# EAGLE design CC3200_Breakout (EAGLE 7.1.0)
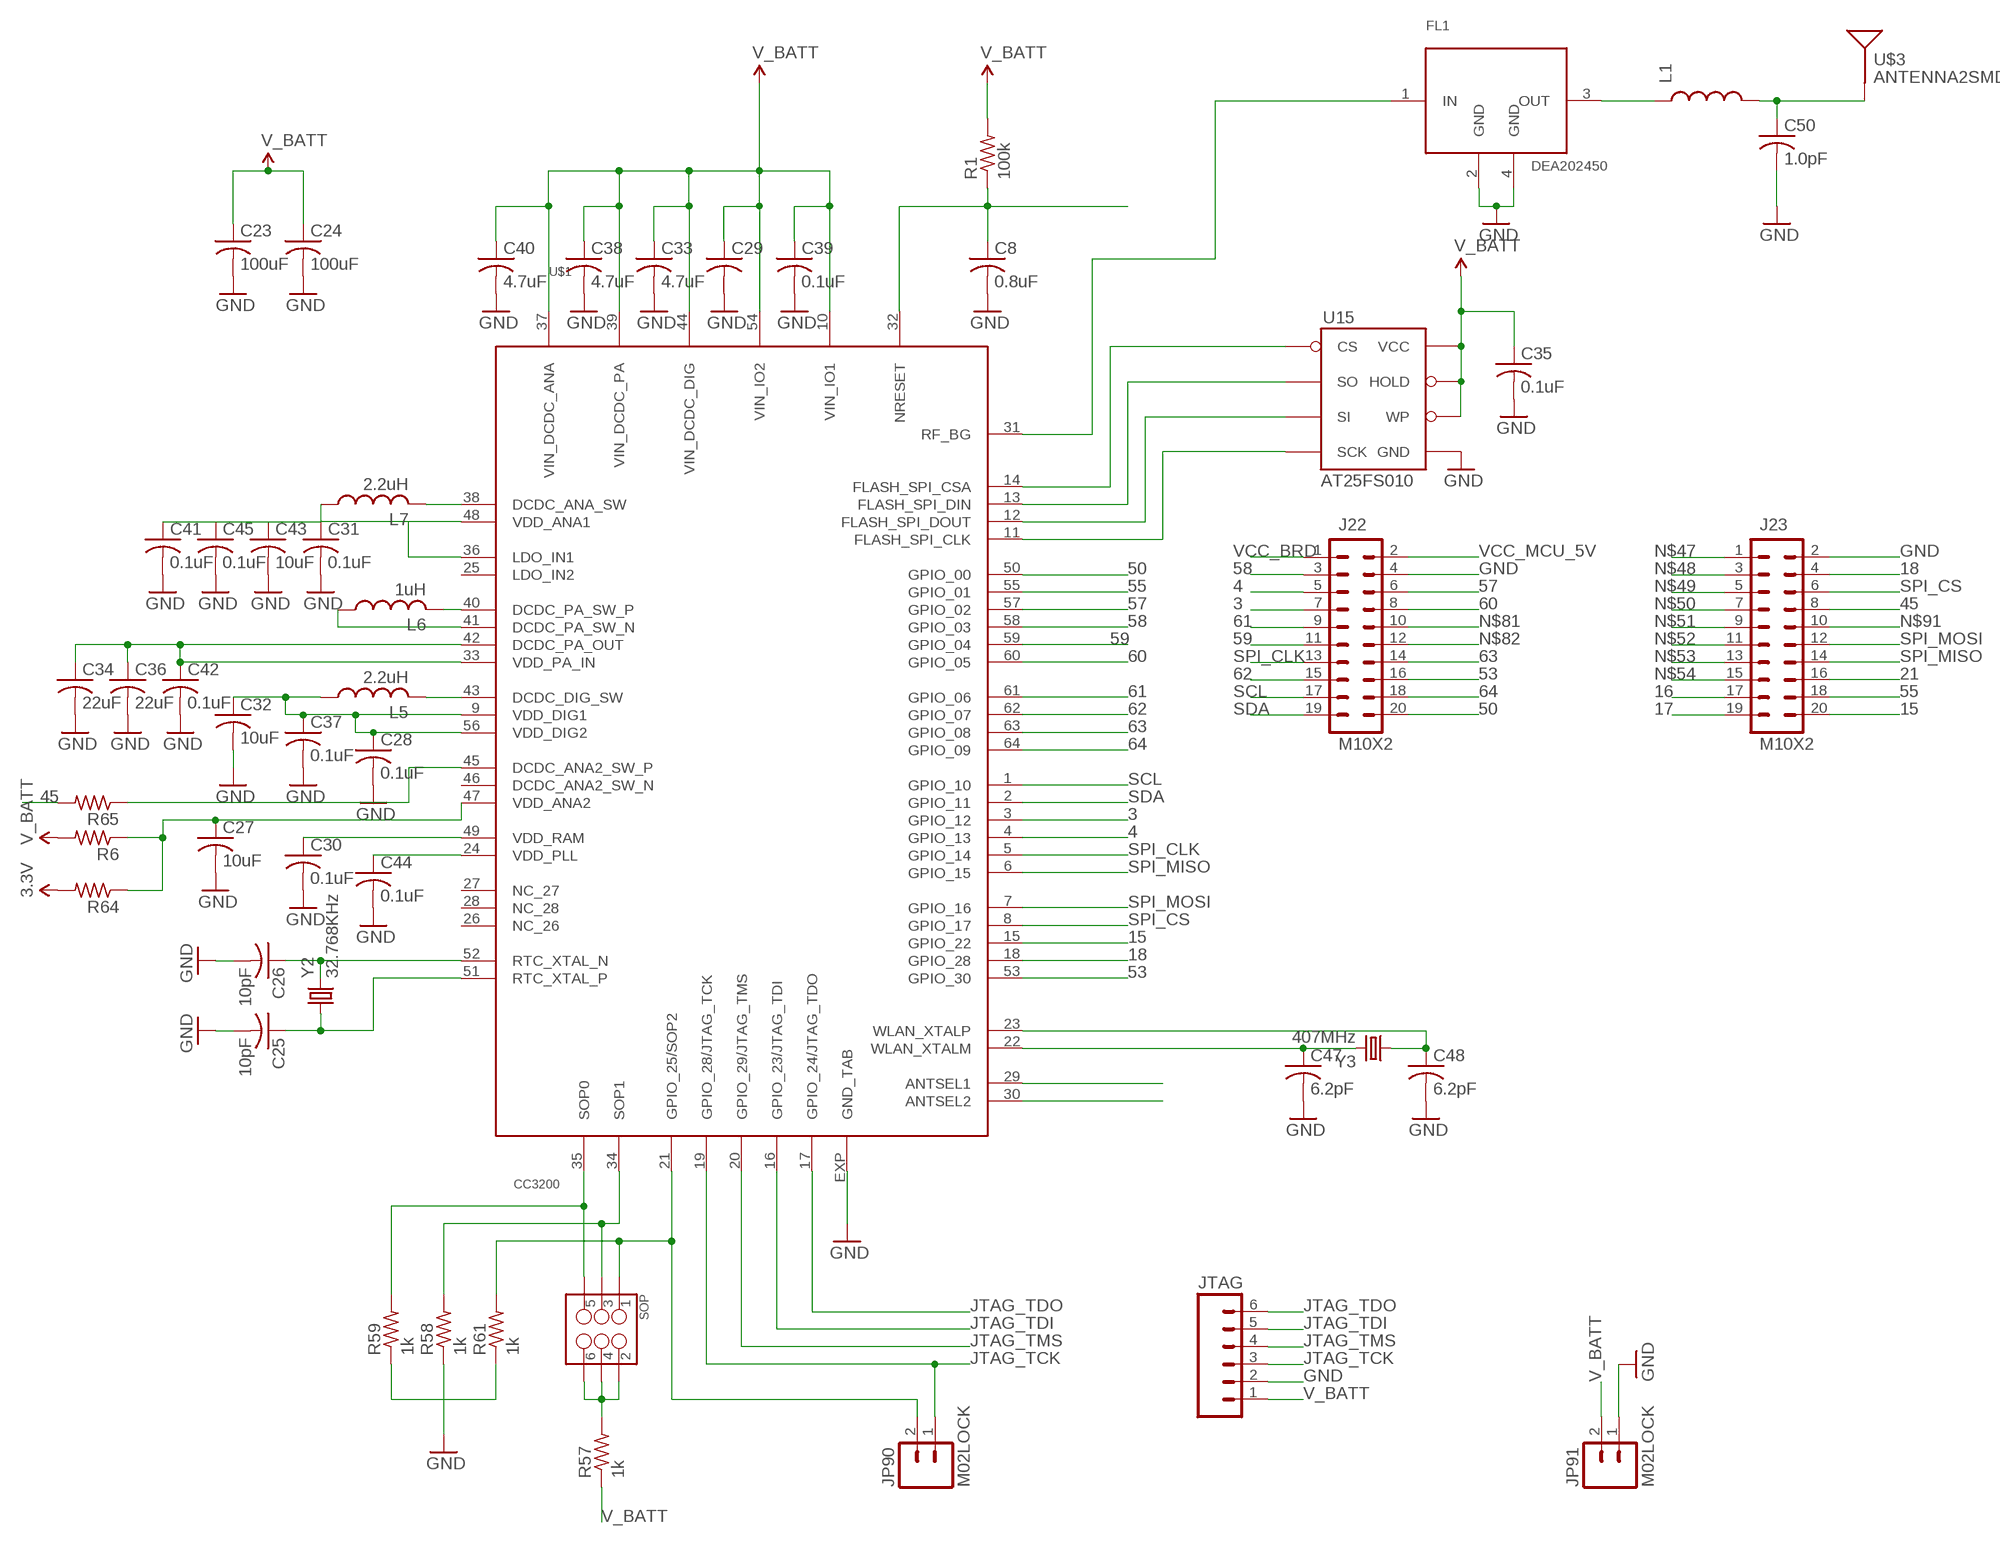
[diagram p0: schematic, sheet 1]

## Parts
C8  0.8uF  C-USC0402K  [C0402K]
C23  100uF  C-USC0402K  [C0402K]
C24  100uF  C-USC0402K  [C0402K]
C25  10pF  C-USC0402K  [C0402K]
C26  10pF  C-USC0402K  [C0402K]
C27  10uF  C-USC0402K  [C0402K]
C28  0.1uF  C-USC0402K  [C0402K]
C29  C-USC0402K  [C0402K]
C30  0.1uF  C-USC0402K  [C0402K]
C31  0.1uF  C-USC0402K  [C0402K]
C32  10uF  C-USC0402K  [C0402K]
C33  4.7uF  C-USC0402K  [C0402K]
C34  22uF  C-USC0402K  [C0402K]
C35  0.1uF  C-USC0402K  [C0402K]
C36  22uF  C-USC0402K  [C0402K]
C37  0.1uF  C-USC0402K  [C0402K]
C38  4.7uF  C-USC0402K  [C0402K]
C39  0.1uF  C-USC0402K  [C0402K]
C40  4.7uF  C-USC0402K  [C0402K]
C41  0.1uF  C-USC0402K  [C0402K]
C42  0.1uF  C-USC0402K  [C0402K]
C43  10uF  C-USC0402K  [C0402K]
C44  0.1uF  C-USC0402K  [C0402K]
C45  0.1uF  C-USC0402K  [C0402K]
C47  6.2pF  C-USC0402K  [C0402K]
C48  6.2pF  C-USC0402K  [C0402K]
C50  1.0pF  C-USC0402K  [C0402K]
FL1  DEA202450  [DEA202450]
J22  M10X2  [2X10]
J23  M10X2  [2X10]
JP90  M02LOCK  [1X02_LOCK]
JP91  M02LOCK  [1X02_LOCK]
JTAG  M06SILK_FEMALE_PTH  [1X06]
L1  INDUCTOR-SPARKFUN0402  [C0402]
L5  2.2uH  L-USL2012C  [L2012C]
L6  1uH  L-USL2012C  [L2012C]
L7  2.2uH  L-USL2012C  [L2012C]
R1  100k  R-US_R0402  [R0402]
R6  R-US_R0402  [R0402]
R57  1k  R-US_R0402  [R0402]
R58  1k  R-US_R0402  [R0402]
R59  1k  R-US_R0402  [R0402]
R61  1k  R-US_R0402  [R0402]
R64  R-US_R0402  [R0402]
R65  R-US_R0402  [R0402]
SOP  M03X22X3_SILK_MALE_PTH  [2X3]
U15  AT25FS010  [SO08WIDE]
U$1  CC3200  [PVQFN-N64]
U$3  ANTENNA2SMD  [ANTENNA-CHIP2]
Y2  32.768KHz  CRYSTAL5X3  [CRYSTAL-SMD-5X3]
Y3  407MHz  CRYSTAL5X3  [CRYSTAL-SMD-5X3]

## Nets
3: J22.7 U$1.3(GPIO_12)
3.3V: R64.2
4: J22.5 U$1.4(GPIO_13)
15: J23.20 U$1.15(GPIO_22)
16: J23.17
17: J23.19
18: J23.4 U$1.18(GPIO_28)
21: J23.16
45: J23.8 R65.2
50: J22.20 U$1.50(GPIO_00)
53: J22.16 U$1.53(GPIO_30)
55: J23.18 U$1.55(GPIO_01)
57: J22.6 U$1.57(GPIO_02)
58: J22.3 U$1.58(GPIO_03)
59: J22.11 U$1.59(GPIO_04)
60: J22.8 U$1.60(GPIO_05)
61: J22.9 U$1.61(GPIO_06)
62: J22.15 U$1.62(GPIO_07)
63: J22.14 U$1.63(GPIO_08)
64: J22.18 U$1.64(GPIO_09)
GND: C8.2 C23.2 C24.2 C25.2 C26.2 C27.2 C28.2 C29.2 C30.2 C31.2 C32.2 C33.2 C34.2 C35.2 C36.2 C37.2 C38.2 C39.2 C40.2 C41.2 C42.2 C43.2 C44.2 C45.2 C47.2 C48.2 C50.1 C50.2 FL1.2(GND) FL1.4(GND) J22.4 J23.2 JP91.1 JTAG.2 L1.2 R58.1 R59.1 R61.1 U15.4(GND) U$1.EXP(GND_TAB) U$3.FEED(SIGNAL)
JTAG_TCK: JP90.1 JTAG.3 U$1.19(GPIO_28/JTAG_TCK)
JTAG_TDI: JTAG.5 U$1.16(GPIO_23/JTAG_TDI)
JTAG_TDO: JTAG.6 U$1.17(GPIO_24/JTAG_TDO)
JTAG_TMS: JTAG.4 U$1.20(GPIO_29/JTAG_TMS)
N$1: C26.1 U$1.52(RTC_XTAL_N) Y2.3
N$2: C25.1 U$1.51(RTC_XTAL_P) Y2.1
N$3: C31.1 C41.1 C43.1 C45.1 L7.1 U$1.36(LDO_IN1) U$1.48(VDD_ANA1)
N$4: L7.2 U$1.38(DCDC_ANA_SW)
N$5: U$1.29(ANTSEL1)
N$6: R57.2 SOP.2 SOP.4 SOP.6
N$7: L6.2 U$1.40(DCDC_PA_SW_P)
N$8: L6.1 U$1.41(DCDC_PA_SW_N)
N$9: FL1.1(IN) U$1.31(RF_BG)
N$10: C34.1 C36.1 C42.1 U$1.33(VDD_PA_IN) U$1.42(DCDC_PA_OUT)
N$11: L5.2 U$1.43(DCDC_DIG_SW)
N$12: R65.1 U$1.45(DCDC_ANA2_SW_P)
N$13: R59.2 SOP.5 U$1.35(SOP0)
N$14: C8.1 R1.1 U$1.32(NRESET)
N$17: C28.1 C32.1 C37.1 L5.1 U$1.9(VDD_DIG1) U$1.56(VDD_DIG2)
N$18: C30.1 U$1.49(VDD_RAM)
N$19: C44.1 U$1.24(VDD_PLL)
N$20: C27.1 R6.1 R64.1 U$1.47(VDD_ANA2)
N$21: R58.2 SOP.3 U$1.34(SOP1)
N$22: JP90.2 R61.2 SOP.1 U$1.21(GPIO_25/SOP2)
N$27: U$1.30(ANTSEL2)
N$28: C47.1 U$1.22(WLAN_XTALM) Y3.3
N$29: C48.1 U$1.23(WLAN_XTALP) Y3.1
N$30: U15.1(CS) U$1.14(FLASH_SPI_CSA)
N$31: U15.2(SO) U$1.13(FLASH_SPI_DIN)
N$32: U15.5(SI) U$1.12(FLASH_SPI_DOUT)
N$33: U15.6(SCK) U$1.11(FLASH_SPI_CLK)
N$36: FL1.3(OUT) L1.1
N$47: J23.1
N$48: J23.3
N$49: J23.5
N$50: J23.7
N$51: J23.9
N$52: J23.11
N$53: J23.13
N$54: J23.15
N$81: J22.10
N$82: J22.12
N$91: J23.10
SCL: J22.17 U$1.1(GPIO_10)
SDA: J22.19 U$1.2(GPIO_11)
SPI_CLK: J22.13 U$1.5(GPIO_14)
SPI_CS: J23.6 U$1.8(GPIO_17)
SPI_MISO: J23.14 U$1.6(GPIO_15)
SPI_MOSI: J23.12 U$1.7(GPIO_16)
V_BATT: C23.1 C24.1 C29.1 C33.1 C35.1 C38.1 C39.1 C40.1 JP91.2 JTAG.1 R1.2 R6.2 R57.1 U15.3(WP) U15.7(HOLD) U15.8(VCC) U$1.10(VIN_IO1) U$1.37(VIN_DCDC_ANA) U$1.39(VIN_DCDC_PA) U$1.44(VIN_DCDC_DIG) U$1.54(VIN_IO2)
VCC_BRD: J22.1
VCC_MCU_5V: J22.2
Unconnected: U$1.25(LDO_IN2) U$1.26(NC_26) U$1.27(NC_27) U$1.28(NC_28) U$1.46(DCDC_ANA2_SW_N)

## Library data of the parts
C8 C23-C45 C47 C48 C50 = resistor:C-US: CAPACITOR, American symbol
FL1 = DEA202450:DEA202450
J22 J23 = SparkFun-Connectors:M10X2: This was SPECIALLY designed to be used with our Graphic LCD Backpack. Be sure you want to use this! It is not only staggered on each line of header holes, but IT IS ALSO offset of the center point of the top and bottom lines by 5 mil. This causes the headers to lock into place on the "standard" footprint on the LCD screen. The extra squares on the tdocu layer are there simply to reference other pins (if you were to actually populate a longer header than ten long - this is what we do with the backpacks).
JP90 JP91 = SparkFun-Connectors:M02: Standard 2-pin 0.1" header. Use with - straight break away headers ( PRT-00116) - right angle break away headers (PRT-00553) - swiss pins (PRT-00743) - machine pins (PRT-00117) - female headers (PRT-00115) Molex polarized connector foot print use with: PRT-08233 with associated crimp pins and housings. 2.54_SCREWTERM for use with PRT-10571. 3.5mm Screw Terminal footprints for PRT-08084 5mm Screw Terminal footprints for use with PRT-08432
JTAG = SparkFun-Connectors:M06: Header 6 Standard 6-pin 0.1" header. Use with straight break away headers (SKU : PRT-00116), right angle break away headers (PRT-00553), swiss pins (PRT-00743), machine pins (PRT-00117), and female headers (PRT-00115). Molex polarized connector foot print use with SKU : PRT-08094 with associated crimp pins and housings. NOTES ON THE VARIANTS LOCK and LOCK_LONGPADS... This footprint was designed to help hold the alignment of a through-hole component (i.e. 6-pin header) while soldering it into place. You may notice that each hole has been shifted either up or down by 0.005 of an inch from it's more standard position (which is a perfectly straight line). This slight alteration caused the pins (the squares in the middle) to touch the edges of the holes. Because they are alternating, it causes a "brace" to hold the component in place. 0.005 has proven to be the perfect amount of "off-center" position when using our standard breakaway headers. Although looks a little odd when you look at the bare footprint, once you have a header in there, the alteration is very hard to notice. Also,if you push a header all the way into place, it is covered up entirely on the bottom side. This idea of altering the position of holes to aid alignment will be further integrated into the Sparkfun Library for other footprints. It can help hold any component with 3 or more connection pins.; PROD_ID: CONN-08437
L1 = Spark:INDUCTOR-SPARKFUN: Inductors Basic Inductor/Choke - 0603 and 1206. Footprints are not proven and vary greatly between part numbers. SRN6045- 33uH, 20% 1.4A
L5-L7 = resistor:L-US: INDUCTOR, American symbol
R1 R6 R57-R59 R61 R64 R65 = resistor:R-US_: RESISTOR, American symbol
SOP = SparkFun-Connectors:M03X2: 2x3 .1" header. Shrouded, with keying- CONN-10681 SMT- CONN-11415 Pogo pins- HW-11044; PROD_ID: CONN-09701
U15 = SparkFun-DigitalIC:AT25FS010: 1-Mbit SPI flash memory
U$1 = cc3200:CC3200
U$3 = SparkFun-RF:ANTENNA2: Chip antenna Single endded antenna. Common with smaller chip antennas. CHIP4 package is the GPS Chip Antenna SKU: GPS-08418. CHIP5 package is 2.4GHz chip antenna SKU: WRL-00144.
Y2 Y3 = SparkFun-FreqCtrl:CRYSTAL: Various standard crystals. Proven footprints. Spark Fun Electronics SKU : COM-00534

## Board
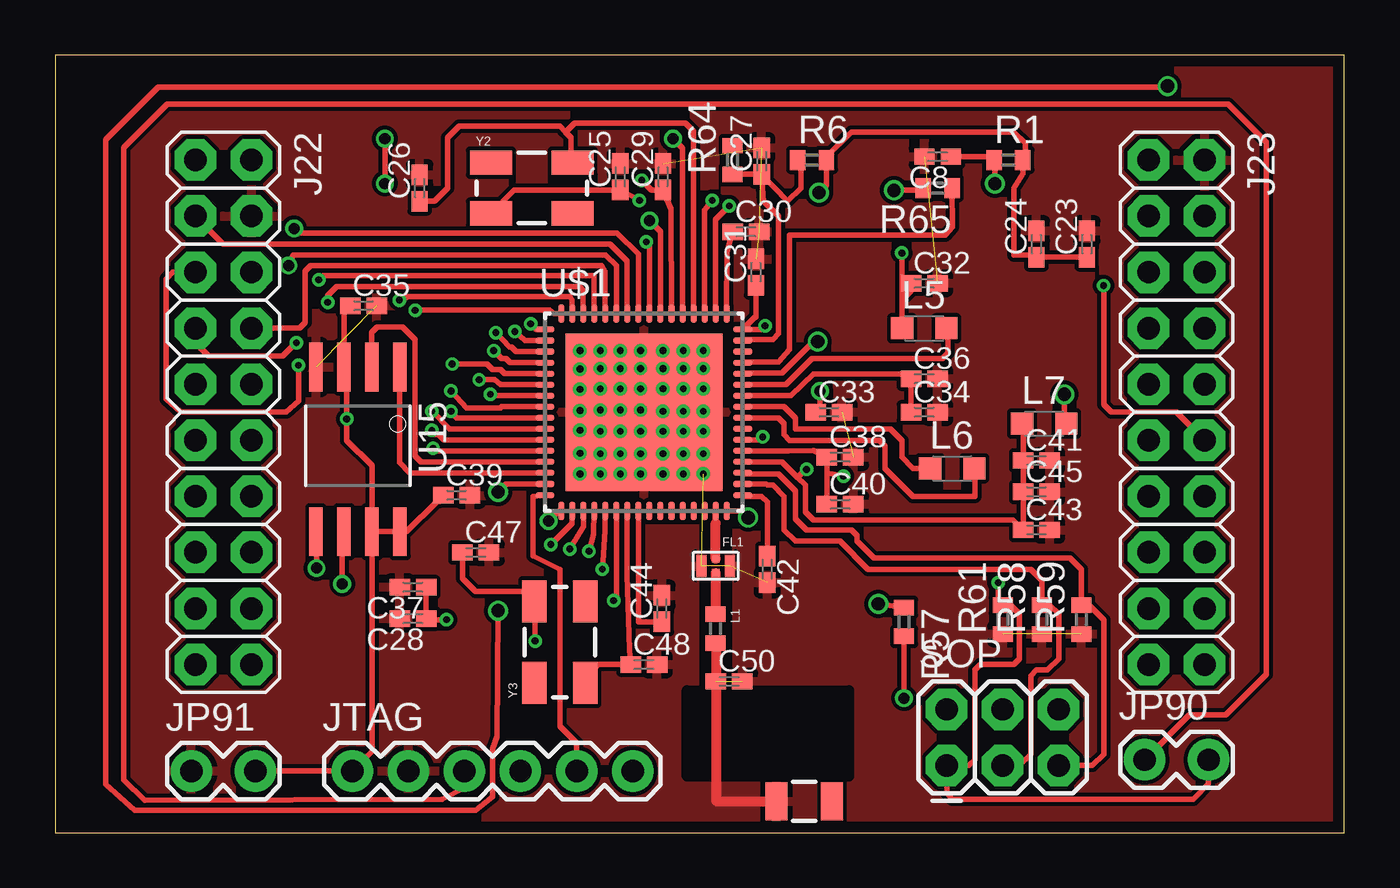
[diagram p1: board, top side]
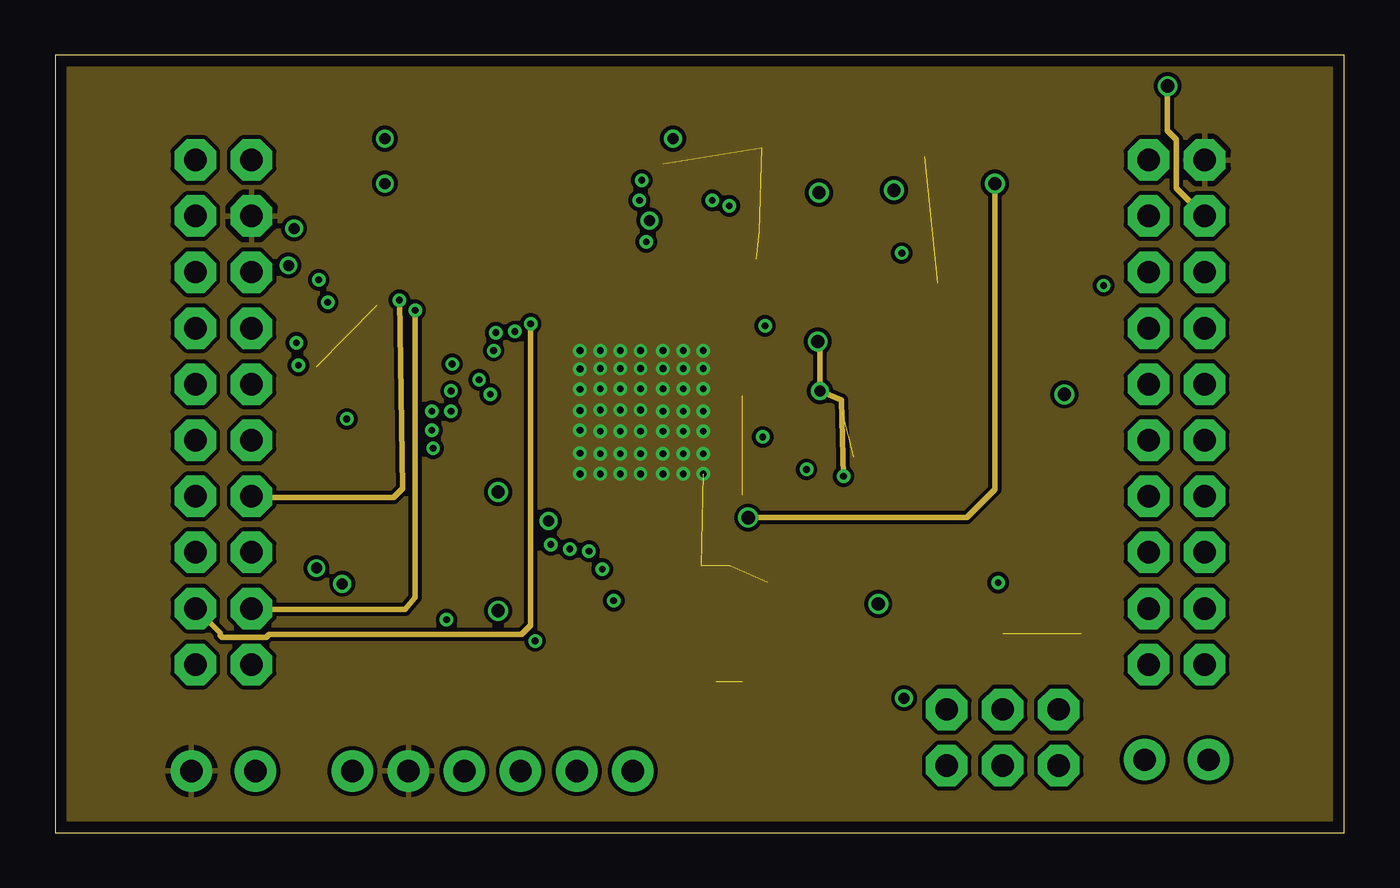
[diagram p2: board, inner layer $GND]
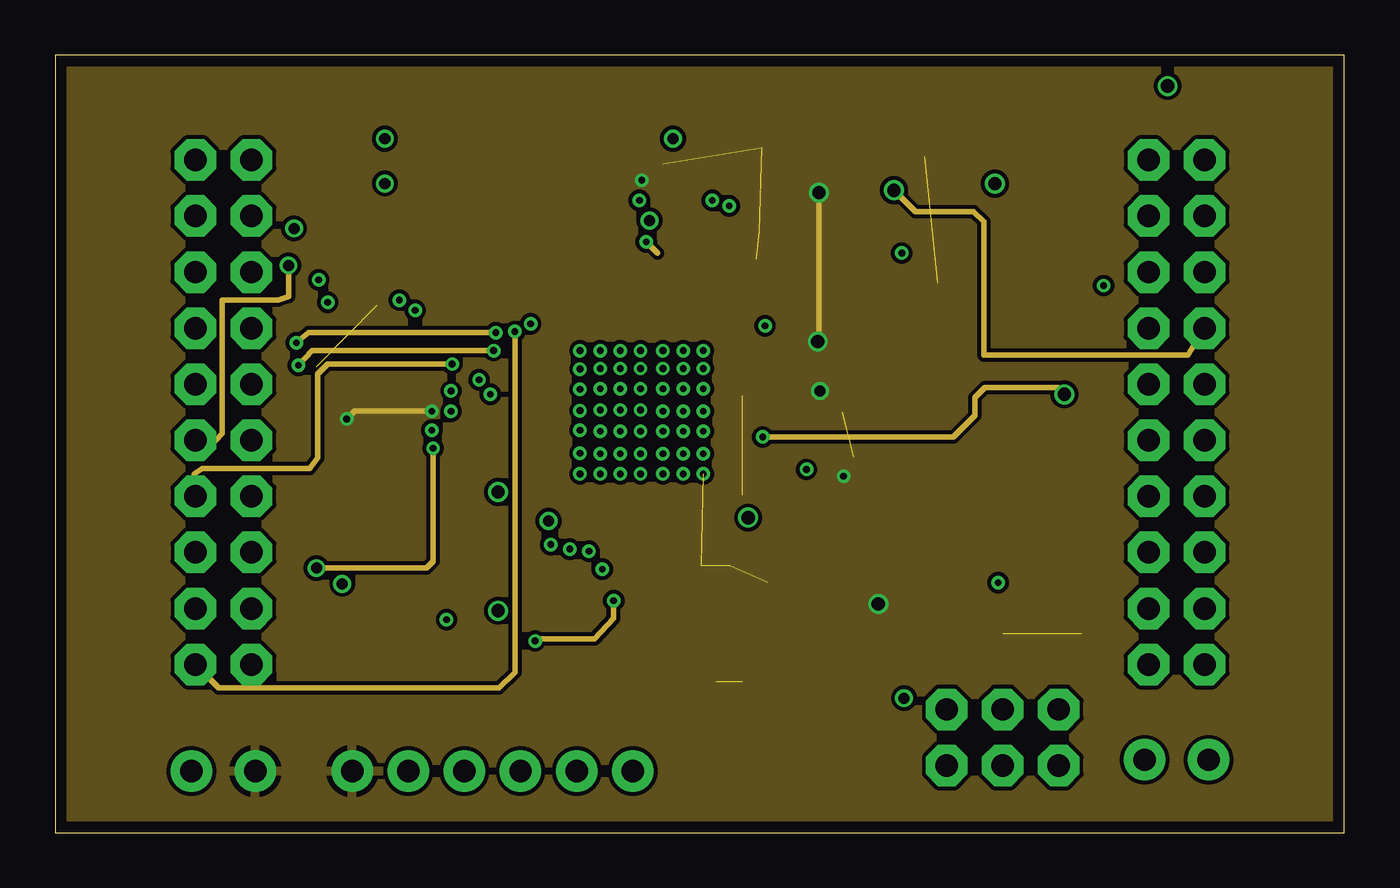
[diagram p3: board, inner layer $V_BATT]
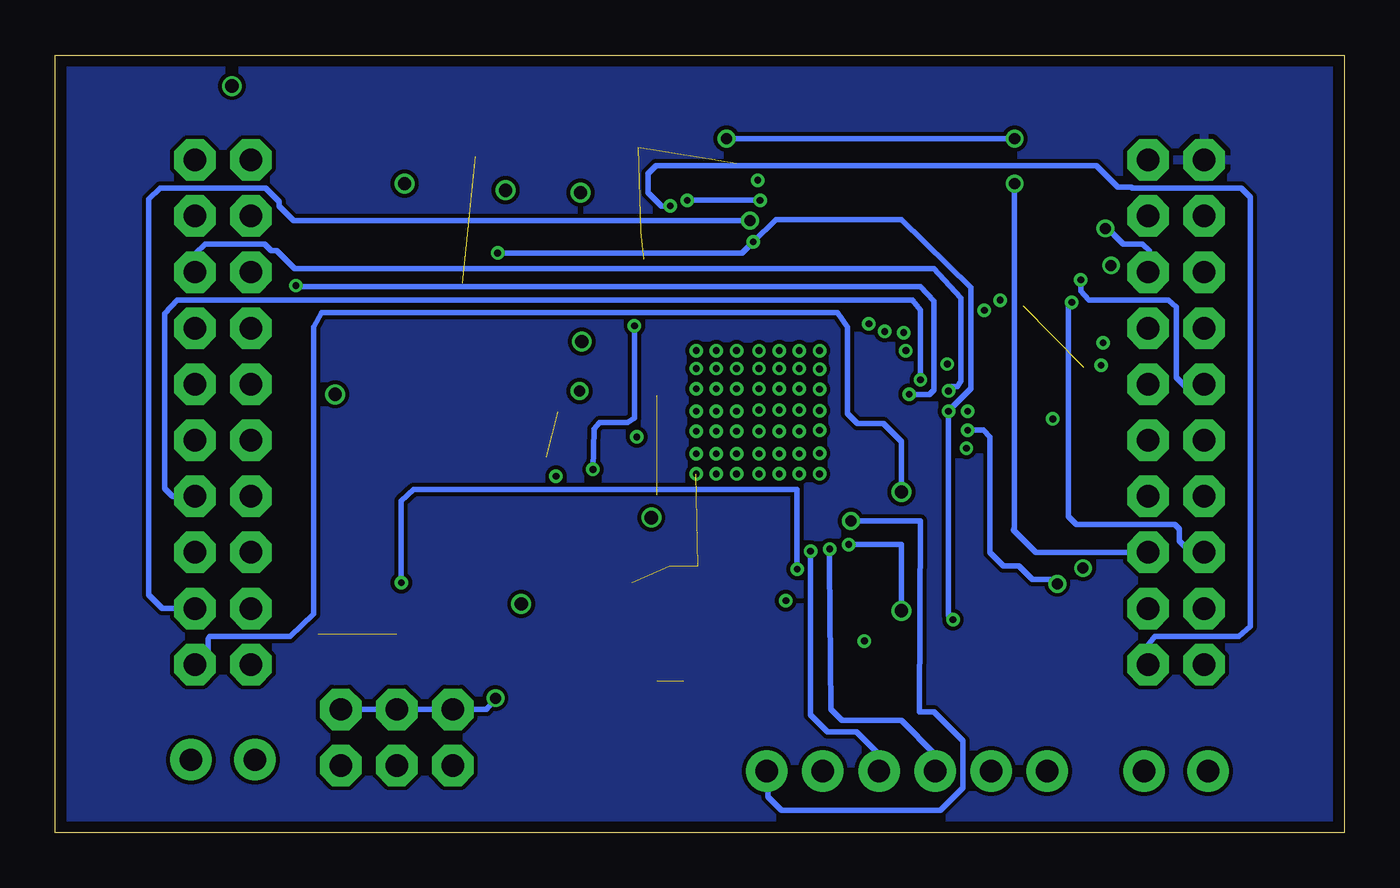
[diagram p4: board, bottom side, seen from below]

Size 58.4 x 35.23 mm. Coordinates in mm from the lower left corner, seen from the top.
Outline: 0,0 58.4,0 58.4,35.23 0,35.23 0,0
Copper layers (1*2*15*16): Top 0.035mm / dielectric 1.5mm / $GND 0.035mm / dielectric 0.15mm / $V_BATT 0.035mm / dielectric 0.2mm / Bottom 0.035mm
Design rules "EagleRules *": minimum track width 7mil, minimum drill 12mil, track to track 7mil, track to pad 7mil, pad to pad 7mil, via to via 7mil, smd to smd 0mil, copper to edge 20mil, drill to drill 10mil, minimum pad ring 10mil, minimum via ring 6mil, stop-mask expansion 2mil, vias tented up to drill 25mil, thermal gap 10mil

### Footprints (pad centres in the part's own frame; a part is rotated, then mirrored left to right if it is on the bottom)
C0402K = smd 0.925 x 0.74: 1 -0.6,0; 2 0.6,0
DEA202450 = smd 0.35 x 0.35: 1 0,-0.325; 3 0,0.325 | smd 0.45 x 1: 2 0.65,0; 4 -0.65,0
2X10 = drill 1.016 pad 1.88 octagon: 1 -11.43,-1.27; 2 -11.43,1.27; 3 -8.89,-1.27; 4 -8.89,1.27; 5 -6.35,-1.27; 6 -6.35,1.27; 7 -3.81,-1.27; 8 -3.81,1.27; 9 -1.27,-1.27; 10 -1.27,1.27; 11 1.27,-1.27; 12 1.27,1.27; 13 3.81,-1.27; 14 3.81,1.27; 15 6.35,-1.27; 16 6.35,1.27; 17 8.89,-1.27; 18 8.89,1.27; 19 11.43,-1.27; 20 11.43,1.27
1X02_LOCK = drill 1.016 pad 1.88: 1 -0.178,0; 2 2.718,0
1X06 = drill 1.016 pad 1.88: 1 0,0; 2 2.54,0; 3 5.08,0; 4 7.62,0; 5 10.16,0; 6 12.7,0
C0402 = smd 0.7 x 0.9: 1 -0.65,0; 2 0.65,0
L2012C = smd 1 x 1: 1 -1,0; 2 1,0
R0402 = smd 0.7 x 0.9: 1 -0.65,0; 2 0.65,0
2X3 = drill 1.016 pad 1.88 octagon: 1 0,0; 2 0,2.54; 3 2.54,0; 4 2.54,2.54; 5 5.08,0; 6 5.08,2.54
SO08WIDE = smd 0.61 x 2.21: 1 -1.905,-3.569; 2 -0.635,-3.569; 3 0.635,-3.569; 4 1.905,-3.569; 5 1.905,3.886; 6 0.635,3.886; 7 -0.635,3.886; 8 -1.905,3.886
PVQFN-N64 = smd 0.85 x 0.28: 1 -4.475,3.75; 2 -4.475,3.25; 3 -4.475,2.75; 4 -4.475,2.25; 5 -4.475,1.75; 6 -4.475,1.25; 7 -4.475,0.75; 8 -4.475,0.25; 9 -4.475,-0.25; 10 -4.475,-0.75; 11 -4.475,-1.25; 12 -4.475,-1.75; 13 -4.475,-2.25; 14 -4.475,-2.75; 15 -4.475,-3.25; 16 -4.475,-3.75; 33 4.475,-3.75; 34 4.475,-3.25; 35 4.475,-2.75; 36 4.475,-2.25; 37 4.475,-1.75; 38 4.475,-1.25; 39 4.475,-0.75; 40 4.475,-0.25; 41 4.475,0.25; 42 4.475,0.75; 43 4.475,1.25; 44 4.475,1.75; 45 4.475,2.25; 46 4.475,2.75; 47 4.475,3.25; 48 4.475,3.75 | smd 0.28 x 0.85: 17 -3.75,-4.475; 18 -3.25,-4.475; 19 -2.75,-4.475; 20 -2.25,-4.475; 21 -1.75,-4.475; 22 -1.25,-4.475; 23 -0.75,-4.475; 24 -0.25,-4.475; 25 0.25,-4.475; 26 0.75,-4.475; 27 1.25,-4.475; 28 1.75,-4.475; 29 2.25,-4.475; 30 2.75,-4.475; 31 3.25,-4.475; 32 3.75,-4.475; 49 3.75,4.475; 50 3.25,4.475; 51 2.75,4.475; 52 2.25,4.475; 53 1.75,4.475; 54 1.25,4.475; 55 0.75,4.475; 56 0.25,4.475; 57 -0.25,4.475; 58 -0.75,4.475; 59 -1.25,4.475; 60 -1.75,4.475; 61 -2.25,4.475; 62 -2.75,4.475; 63 -3.25,4.475; 64 -3.75,4.475 | smd 7.112 x 7.112: EXP 0,0
ANTENNA-CHIP2 = smd 1.7 x 1: FEED 0,1.25; P$2 0,-1.25
CRYSTAL-SMD-5X3 = smd 1.9 x 1.1: 1 -1.85,-1.15; 2 1.85,-1.15; 3 1.85,1.15; 4 -1.85,1.15

### Placement (x,y rotation side)
C8  39.98,30.63 180 top
C23  46.74,26.67 90 top
C24  44.45,26.67 90 top
C25  25.6,29.72 90 top
C26  16.51,29.21 90 top
C27  32,30.43 90 top
C28  16.21,9.7 180 top
C29  27.53,29.72 90 top
C30  31.29,27.23 0 top
C31  31.75,25.4 90 top
C32  39.37,24.89 0 top
C33  35.05,19.05 0 top
C34  39.37,19.05 0 top
C35  13.97,23.88 0 top
C36  39.37,20.57 0 top
C37  16.21,11.13 180 top
C38  35.56,17.02 0 top
C39  18.19,15.29 0 top
C40  35.56,14.88 0 top
C41  44.45,16.87 0 top
C42  32.26,11.94 270 top
C43  44.45,13.72 0 top
C44  27.48,10.16 90 top
C45  44.45,15.44 0 top
C47  19.05,12.7 0 top
C48  26.67,7.62 0 top
C50  30.53,6.86 0 top
FL1  29.92,12.09 180 top
J22  7.62,19.05 270 top
J23  50.8,19.05 270 top
JP90  49.53,3.3 0 top
JP91  6.35,2.79 0 top
JTAG  13.46,2.79 0 top
L1  29.92,9.25 270 top
L5  39.37,22.86 0 top
L6  40.64,16.51 0 top
L7  44.81,18.54 0 top
R1  43.18,30.48 0 top
R6  34.29,30.48 0 top
R57  38.46,9.55 270 top
R58  44.7,9.65 90 top
R59  46.48,9.65 90 top
R61  42.93,9.65 90 top
R64  30.68,30.48 90 top
R65  39.98,29.21 180 top
SOP  40.39,3.05 0 top
U15  13.72,17.53 180 top
U$1  26.67,19.05 0 top
U$3  33.93,1.42 90 top
Y2  21.59,29.21 0 top
Y3  22.86,8.64 90 top

### Tracks (layer width: path | path; a pad name or v marks a point on that pad's centre or on a via)
3  (via drill 0.3)
  Top 0.254: U$1.3 20.87,21.8 20.68,22 20.57,22 v19.96,22.66 | J22.7 6.35,22.2 6.96,21.59 10.31,21.59 v10.92,22.2
  $V_BATT 0.254: v19.96,22.66 11.48,22.66 v10.92,22.2
4  (via drill 0.3)
  Top 0.254: U$1.4 20.61,21.3 20.42,21.49 20.22,21.49 v19.86,21.84 | v11.02,21.18 11.02,19.56 10.46,19.05 5.69,19.05 5.03,19.66 5.03,25.09 5.33,25.4 J22.5
  $V_BATT 0.254: v19.86,21.84 11.63,21.84 v11.02,21.18
15  (via drill 0.6)
  Top 0.254: U$1.15 20.42,15.8 v20.07,15.44
  Bottom 0.254: v20.07,15.44 20.07,17.73 20.88,18.54 22.05,18.54 22.5,19 22.5,22.91 22.96,23.57 46.33,23.57 46.69,22.91 46.69,9.91 47.75,8.89 51.41,8.89 51.46,8.79 51.46,8.23 J23.20
18  (via drill 0.3, 0.6)
  Top 0.254: U$1.18 23.42,14.02 v22.45,13.06 | v20.07,10.06 20.02,4.37 19.81,3.81 19.81,1.63 19.05,1.02 3.61,1.02 2.29,2.18 2.29,31.39 4.67,33.78 50.34,33.78 v50.39,33.83
  $GND 0.254: v50.39,33.83 50.39,31.8 50.8,31.39 50.8,29.21 J23.4
  Bottom 0.254: v22.45,13.06 20.07,13.06 v20.07,10.06
45  (via drill 0.6)
  Top 0.254: v38,29.11 39.23,29.11 R65.2
  $V_BATT 0.254: J23.8 51.31,21.64 42.06,21.64 42.06,27.69 41.6,28.14 38.96,28.14 v38,29.11
50  (via drill 0.3)
  Top 0.254: U$1.50 29.92,27.79 v30.53,28.4
  Bottom 0.254: v30.53,28.4 30.94,28.4 31.55,29.01 31.55,29.87 31.19,30.23 11.23,30.23 10.26,29.26 9.65,29.26 9.6,29.21 4.67,29.21 4.27,28.8 4.27,9.35 4.78,8.89 8.59,8.89 8.99,8.38 8.99,7.72 J22.20
53  (via drill 0.5)
  Top 0.254: U$1.53 28.42,31.02 v27.99,31.45 | v14.94,31.45 v14.94,29.41
  Bottom 0.254: v27.99,31.45 v14.94,31.45 | J22.16 13.97,12.7 14.99,13.72 14.94,13.77 v14.94,29.41
55  (via drill 0.5)
  Top 0.254: U$1.55 27.42,27.24 v26.92,27.74
  Bottom 0.254: v26.92,27.74 47.6,27.74 48.26,28.4 48.26,28.6 48.87,29.21 53.65,29.21 54.15,28.7 54.15,10.77 53.54,10.16 J23.18
57  (via drill 0.5)
  Top 0.254: U$1.57 26.42,26.21 25.45,27.18 11.02,27.18 v10.82,27.38
  Bottom 0.254: v10.82,27.38 10.72,27.38 10.01,26.67 9.14,26.67 8.84,26.36 8.84,25.45 J22.6
58
  Top 0.254: J22.3 7.62,26.67 25.15,26.67 25.91,25.91 25.91,23.54 U$1.58
59  (via drill 0.5)
  Top 0.254: U$1.59 25.42,25.68 24.94,26.16 10.77,26.16 v10.57,25.7
  $V_BATT 0.254: v10.57,25.7 10.57,24.28 10.11,24.13 7.57,24.13 7.57,18.09 7.26,17.78 J22.11
60
  Top 0.254: U$1.60 24.92,25.42 24.74,25.7 11.58,25.7 11.33,25.45 11.33,23.11 11.07,22.86 J22.8
61  (via drill 0.3)
  Top 0.254: U$1.61 24.42,25.21 24.33,25.25 12.14,25.25 v11.94,25.04
  Bottom 0.254: v11.94,25.04 11.94,24.54 11.58,24.13 7.98,24.13 7.62,23.82 7.62,20.62 7.21,20.22 6.45,20.22 J22.9
62  (via drill 0.3)
  Top 0.254: U$1.62 23.92,24.59 23.77,24.74 12.75,24.74 12.34,24.33 v12.34,24.03
  Bottom 0.254: J22.15 6.96,12.7 7.47,13.21 7.47,13.77 7.67,13.97 12.14,13.97 12.5,14.33 12.5,23.88 v12.34,24.03
63  (via drill 0.3)
  Top 0.254: U$1.63 23.42,24.13 23.32,24.28 16,24.28 v15.6,24.13
  $GND 0.254: v15.6,24.13 15.75,15.6 15.34,15.19 8.94,15.19 J22.14
64  (via drill 0.3)
  Top 0.254: U$1.64 22.6,23.52 22.4,23.67 v16.31,23.67
  $GND 0.254: v16.31,23.67 16.31,10.67 15.85,10.11 8.94,10.11 J22.18
GND  (via drill 0.3)  (12 unrouted)
  Top 0.457: L1.2 29.93,8.6 C50.1 29.94,1.42 U$3.FEED
  other vias: 23.77,20.09 23.77,19.13 23.77,18.24 23.77,17.2 23.77,16.26 23.77,21.84 23.77,21.01 24.69,21.84 25.6,21.84 26.52,21.84 27.53,21.84 28.45,21.84 29.36,21.84 24.69,21.03 24.69,20.12 24.69,19.15 24.69,18.19 24.69,17.17 24.69,16.26 25.6,21.03 25.6,20.12 25.6,19.15 25.6,18.19 25.6,17.17 25.6,16.26 26.52,21.03 26.52,20.12 26.52,19.15 26.52,18.19 26.52,17.17 26.52,16.26 27.53,21.03 27.53,20.12 27.53,19.1 27.53,18.19 27.53,17.17 27.53,16.26 28.45,21.03 28.45,20.12 28.45,19.1 28.45,18.19 28.45,17.17 28.45,16.26 29.36,21.03 29.36,20.12 29.36,19.1 29.36,18.19 29.36,17.17 29.36,16.26
  pour Top: 0,0 0,39.37 58.42,39.37 58.42,0
  pour $GND: 0,0 0,41.25 58.42,41.25 58.42,0
JTAG_TCK  (via drill 0.3)
  Top 0.254: v23.32,12.85 23.37,12.95 23.93,13.87 23.93,14.48 U$1.19 | JTAG.3 18.54,2.03 17.53,1.52 4.06,1.47 3.1,2.39 3.1,31.04 5.08,33.02 53.14,33.02 54.86,31.29 54.86,7.16 53.03,5.33 51.38,5.33 JP90.1
  Bottom 0.254: JTAG.3 18.54,3.56 20.07,5.08 22.76,5.08 23.27,5.59 23.32,12.09 v23.32,12.85
JTAG_TDI
  Top 0.254: JTAG.5 23.62,4.06 22.86,4.83 22.86,11.94 21.64,12.55 21.64,15.24 U$1.16
JTAG_TDO  (via drill 0.51)
  Top 0.254: U$1.17 22.8,14.57 v22.35,14.12
  Bottom 0.254: v22.35,14.12 19.2,14.12 19.25,5.49 18.59,5.49 17.27,4.17 17.27,2.03 18.29,1.02 25.5,1.02 26.11,1.63 26.11,2.74 JTAG.6
JTAG_TMS  (via drill 0.3)
  Top 0.254: v24.18,12.75 24.38,13.52 U$1.20
  Bottom 0.254: JTAG.4 21.08,3.56 22.1,4.57 23.42,4.57 24.18,5.33 v24.18,12.75
N$1
  Top 0.254: C26.1 17.18,28.61 17.78,29.21 17.78,31.5 18.29,32 22.86,32 23.11,31.75 | 23.11,31.75 23.37,31.5 23.37,30.43 Y2.3 | U$1.52 28.92,31.79 28.55,32.16 23.52,32.16 23.11,31.75
N$2  (via drill 0.3)
  Top 0.254: U$1.51 29.42,28.2 v29.77,28.65 | Y2.1 20.8,29.12 C25.1 25.61,29.11 v26.47,28.65
  Bottom 0.254: v29.77,28.65 v26.47,28.65
N$3  (via drill 0.3)
  Top 0.254: C31.1 31.75,23.37 31.71,23.37 U$1.48 31.94,22.8 v32.16,22.96 | L7.1 43.85,18.54 C41.1 C45.1 C43.1 43.39,14.17 34.34,14.17 33.98,14.53 33.98,15.75 33.63,16.1 | U$1.36 32.93,16.8 33.63,16.1 | v34.04,16.46 33.98,16.46 33.63,16.1
  Bottom 0.254: v32.16,22.96 32.16,18.8 32.46,18.59 33.73,18.59 33.98,18.29 v34.04,16.46
N$4  (via drill 0.3, 0.6)
  Top 0.254: U$1.38 31.92,17.8 v32.05,17.93 | v45.72,19.86 45.72,18.63 L7.2
  $V_BATT 0.254: v32.05,17.93 40.69,17.93 41.66,18.9 41.66,19.71 42.11,20.17 45.41,20.17 v45.72,19.86
N$6  (via drill 0.5)
  Top 0.254: v38.46,6.1 R57.2
  Bottom 0.254: SOP.6 SOP.4 SOP.2 38.86,5.59 v38.46,6.1
N$7
  Top 0.254: U$1.40 32.76,18.8 33.02,18.54 33.02,18.03 33.27,17.78 37.34,17.78 37.59,17.53 37.59,16.51 38.86,15.24 41.66,15.24 41.66,16.49 L6.2
N$8
  Top 0.254: L6.1 38.86,16.51 38.35,17.02 38.35,17.78 37.85,18.29 33.53,18.29 33.53,18.8 33.02,19.3 U$1.41
N$9
  Top 0.305: U$1.31 29.92,14.02
  Top 0.457: FL1.1 29.92,14.02
N$10  (1 unrouted)
  Top 0.254: C42.1 32.26,14.99 32,15.24 31.2,15.24 U$1.33 | C36.1 C34.1 38.77,20.41 38.61,20.78 34.34,20.78 33.33,19.81 31.16,19.81 U$1.42
N$11
  Top 0.254: U$1.43 33.1,20.3 34.29,21.49 40.18,21.49 40.44,21.74 40.44,22.79 L5.2
N$12
  Top 0.254: R65.1 40.64,27.43 40.34,27.08 33.27,27.08 33.27,21.89 32.77,21.34 31.18,21.34 U$1.45
N$13
  Top 0.254: SOP.5 46.99,3.05 47.5,3.56 47.5,9.65 46.85,10.3 R59.2 46.48,11.94 45.97,12.45 37.08,12.45 36.32,13.21 36.32,13.46 36.07,13.72 34.04,13.72 33.53,14.22 33.53,15.49 32.77,16.26 31.19,16.26 U$1.35
N$14  (via drill 0.6)
  Top 0.254: C8.1 42.38,30.63 R1.1 42.57,30.44 v42.57,29.41 | U$1.32 31.09,14.57 v31.39,14.28
  $GND 0.254: v31.39,14.28 41.3,14.28 42.57,15.54 v42.57,29.41
N$15
  cutout Top: 28.6,6.45 35.97,6.45 35.97,2.54 28.6,2.54
N$16
  cutout Top: 29.41,14.17 30.43,14.17 30.43,6.55 29.41,6.55
N$17  (via drill 0.3)
  Top 0.254: C37.1 C28.1 16.86,9.65 v17.73,9.65 | C32.1 38.77,24.55 38.35,24.13 | 38.35,24.13 38.35,22.88 L5.1 | U$1.9 18.18,18.8 v17.93,19.1 | U$1.56 26.92,26.62 v26.77,26.77 | 38.35,24.13 v38.35,26.26
  $V_BATT 0.254: 27.28,26.26 v26.77,26.77
  Bottom 0.254: v17.73,9.65 17.93,9.86 v17.93,19.1 16.92,20.12 16.92,24.69 20.07,27.79 25.76,27.79 v26.77,26.77 27.28,26.26 v38.35,26.26
N$18
  Top 0.254: U$1.49 30.42,24.44 30.43,25.55 30.44,26.31 C30.1
N$19
  Top 0.254: U$1.24 26.42,11.94 26.42,11.43 26.42,9.55 26.83,9.55 C44.1
N$20
  Top 0.254: C27.1 33.18,28.61 33.78,29.21 33.78,30.34 R6.1 | C27.1 32.1,28.61 32.77,27.94 32.77,22.61 32.51,22.35 31.2,22.35 U$1.47 | R64.1 C27.1
N$21
  Top 0.254: SOP.3 43.69,3.05 44.2,3.56 44.2,7.11 44.45,7.37 44.96,7.37 45.47,7.87 45.47,9.91 45.07,10.3 R58.2 44.7,11.43 44.2,11.94 36.83,11.94 35.56,13.21 33.53,13.21 33.02,13.72 33.02,15.24 32.51,15.75 32.26,15.75 32.21,15.8 U$1.34
N$22  (via drill 0.3)
  Top 0.254: JP90.2 52.25,2.21 51.56,1.52 40.64,1.52 40.39,1.78 SOP.1 41.4,3.05 41.66,3.3 41.66,7.37 41.91,7.62 43.43,7.62 43.69,7.87 43.69,9.91 43.29,10.3 R61.2 42.72,10.51 v42.72,11.33 | U$1.21 24.92,13.69 v24.79,11.94
  Bottom 0.254: v24.79,11.94 24.79,15.54 42.16,15.54 42.72,15.04 v42.72,11.33
N$28  (via drill 0.3)
  Top 0.254: C47.1 18.45,11.52 19.05,10.92 21.53,10.92 Y3.3 21.74,10.71 v21.74,8.69 | U$1.22 25.42,10.59 v25.3,10.52
  $V_BATT 0.254: v25.3,10.52 25.3,9.7 24.43,8.79 21.84,8.79 v21.74,8.69
N$29
  Top 0.254: Y3.1 24.59,7.62 C48.1 26.07,7.71 26.01,8.28 25.91,11.68 25.91,14.56 U$1.23
N$30
  Top 0.254: U$1.14 16.06,16.3 15.6,16.76 15.6,21.07 U15.1
N$31
  Top 0.254: U$1.13 16.58,16.8 16.31,17.07 16.31,22.35 15.75,22.91 14.58,22.91 14.33,22.66 14.33,21.74 14.28,21.69 14.28,21.17 U15.2
N$32  (via drill 0.3, 0.5)
  Top 0.254: U$1.12 17.3,17.3 v17.12,17.42 | v11.84,11.99 11.84,13.61 U15.5
  $V_BATT 0.254: v17.12,17.42 17.12,12.29 16.82,11.99 v11.84,11.99
N$33  (via drill 0.3, 0.5)
  Top 0.254: U$1.11 17.61,17.8 17.37,18.03 17.07,18.03 v17.07,18.24 | v13.01,11.28 13.01,13.56 U15.6
  Bottom 0.254: v17.07,18.24 16.36,18.24 16.05,17.93 16.05,12.7 15.44,12.09 14.73,12.09 14.12,11.48 13.16,11.48 v13.01,11.28
N$36
  Top 0.457: FL1.3 L1.1
SCL  (via drill 0.3)
  Top 0.254: U$1.1 21.8,22.8 v21.54,23.06
  $GND 0.254: v21.54,23.06 21.54,9.4 21.13,8.99 9.7,8.99 9.55,8.84 7.57,8.84 7.47,8.94 7.47,9.04 J22.17
SDA  (via drill 0.3)
  Top 0.254: U$1.2 21.29,22.3 v20.83,22.71
  $V_BATT 0.254: v20.83,22.71 20.83,7.26 20.12,6.55 7.42,6.55 J22.19
SPI_CLK  (via drill 0.3)
  Top 0.254: U$1.5 20.35,20.8 20.17,20.98 19.81,20.98 19.56,21.23 v17.98,21.23
  $V_BATT 0.254: v17.98,21.23 12.34,21.23 11.89,20.78 11.89,16.97 11.53,16.51 6.66,16.51 6.3,16.26 6.3,15.29 J22.13
SPI_CS  (via drill 0.3)
  Top 0.254: U$1.8 20.21,19.3 20.17,19.25 18.64,19.25 v17.93,20.02
  Bottom 0.254: v17.93,20.02 17.93,20.07 17.78,20.22 17.53,20.22 17.37,20.47 17.37,24.23 18.59,25.55 47.55,25.55 48.36,26.36 48.62,26.36 48.92,26.67 51.61,26.67 52.07,26.21 J23.6
SPI_MISO  (via drill 0.3)
  Top 0.254: U$1.6 20.19,20.3 19.91,20.52 v19.2,20.52
  Bottom 0.254: v19.2,20.52 19.2,23.67 19.56,24.13 52.88,24.13 53.44,23.52 53.44,15.6 53.09,15.24 J23.14
SPI_MOSI  (via drill 0.3)
  Top 0.254: U$1.7 19.72,19.8 v19.71,19.86 | v47.5,24.79 47.5,19.41 47.85,19.05 50.8,19.05 J23.12
  Bottom 0.254: v19.71,19.86 18.8,19.86 18.59,20.07 18.59,24.08 19.2,24.74 47.45,24.74 v47.5,24.79
V_BATT  (via drill 0.3, 0.51, 0.6)  (1 unrouted)
  Top 0.254: U$1.37 33.2,17.3 34.34,17.32 C38.1 | U15.7 U15.8 15.93,13.64 17.27,14.99 17.59,15.04 C39.1 | U15.7 14.35,16.64 13.21,17.78 v13.21,18.75 13.21,20.97 U15.3 13.08,23.59 C35.1 | C23.1 C24.1 44.36,26.16 43.43,26.16 43.43,29.21 43.83,29.86 R1.2 43.94,30.59 43.94,31.24 43.43,31.75 36.07,31.75 34.94,30.62 R6.2 34.94,29.35 v34.59,29.01 | C38.1 C40.1 | C38.1 34.96,16.3 v35.71,16.15 | v34.65,20.02 34.65,19.24 C33.1 | U$1.54 27.89,28.25 C29.1 27.02,29.12 v26.57,29.57 | U15.7 14.35,3.68 JTAG.1 JP91.2 | U$1.10 17.87,18.3 v17.07,19.1 | v34.54,22.25 34.34,22.25 32.92,20.83 31.17,20.83 U$1.44 | R57.1 v37.29,10.36
  $GND 0.254: v35.71,16.15 35.61,19.61 v34.65,20.02 34.65,22.15 v34.54,22.25
  $V_BATT 0.254: v17.07,19.1 13.56,19.1 v13.21,18.75 | v34.59,29.01 34.59,22.3 v34.54,22.25
  pour $V_BATT: 58.32,0 -0.1,0 0,43.28 58.42,43.28
VCC_BRD
  pour Bottom: 0,0 0,45.47 58.52,45.47 58.42,0